# Altium project MQP_DC_AC_Inverter.PrjPcb (part 2 of 4)
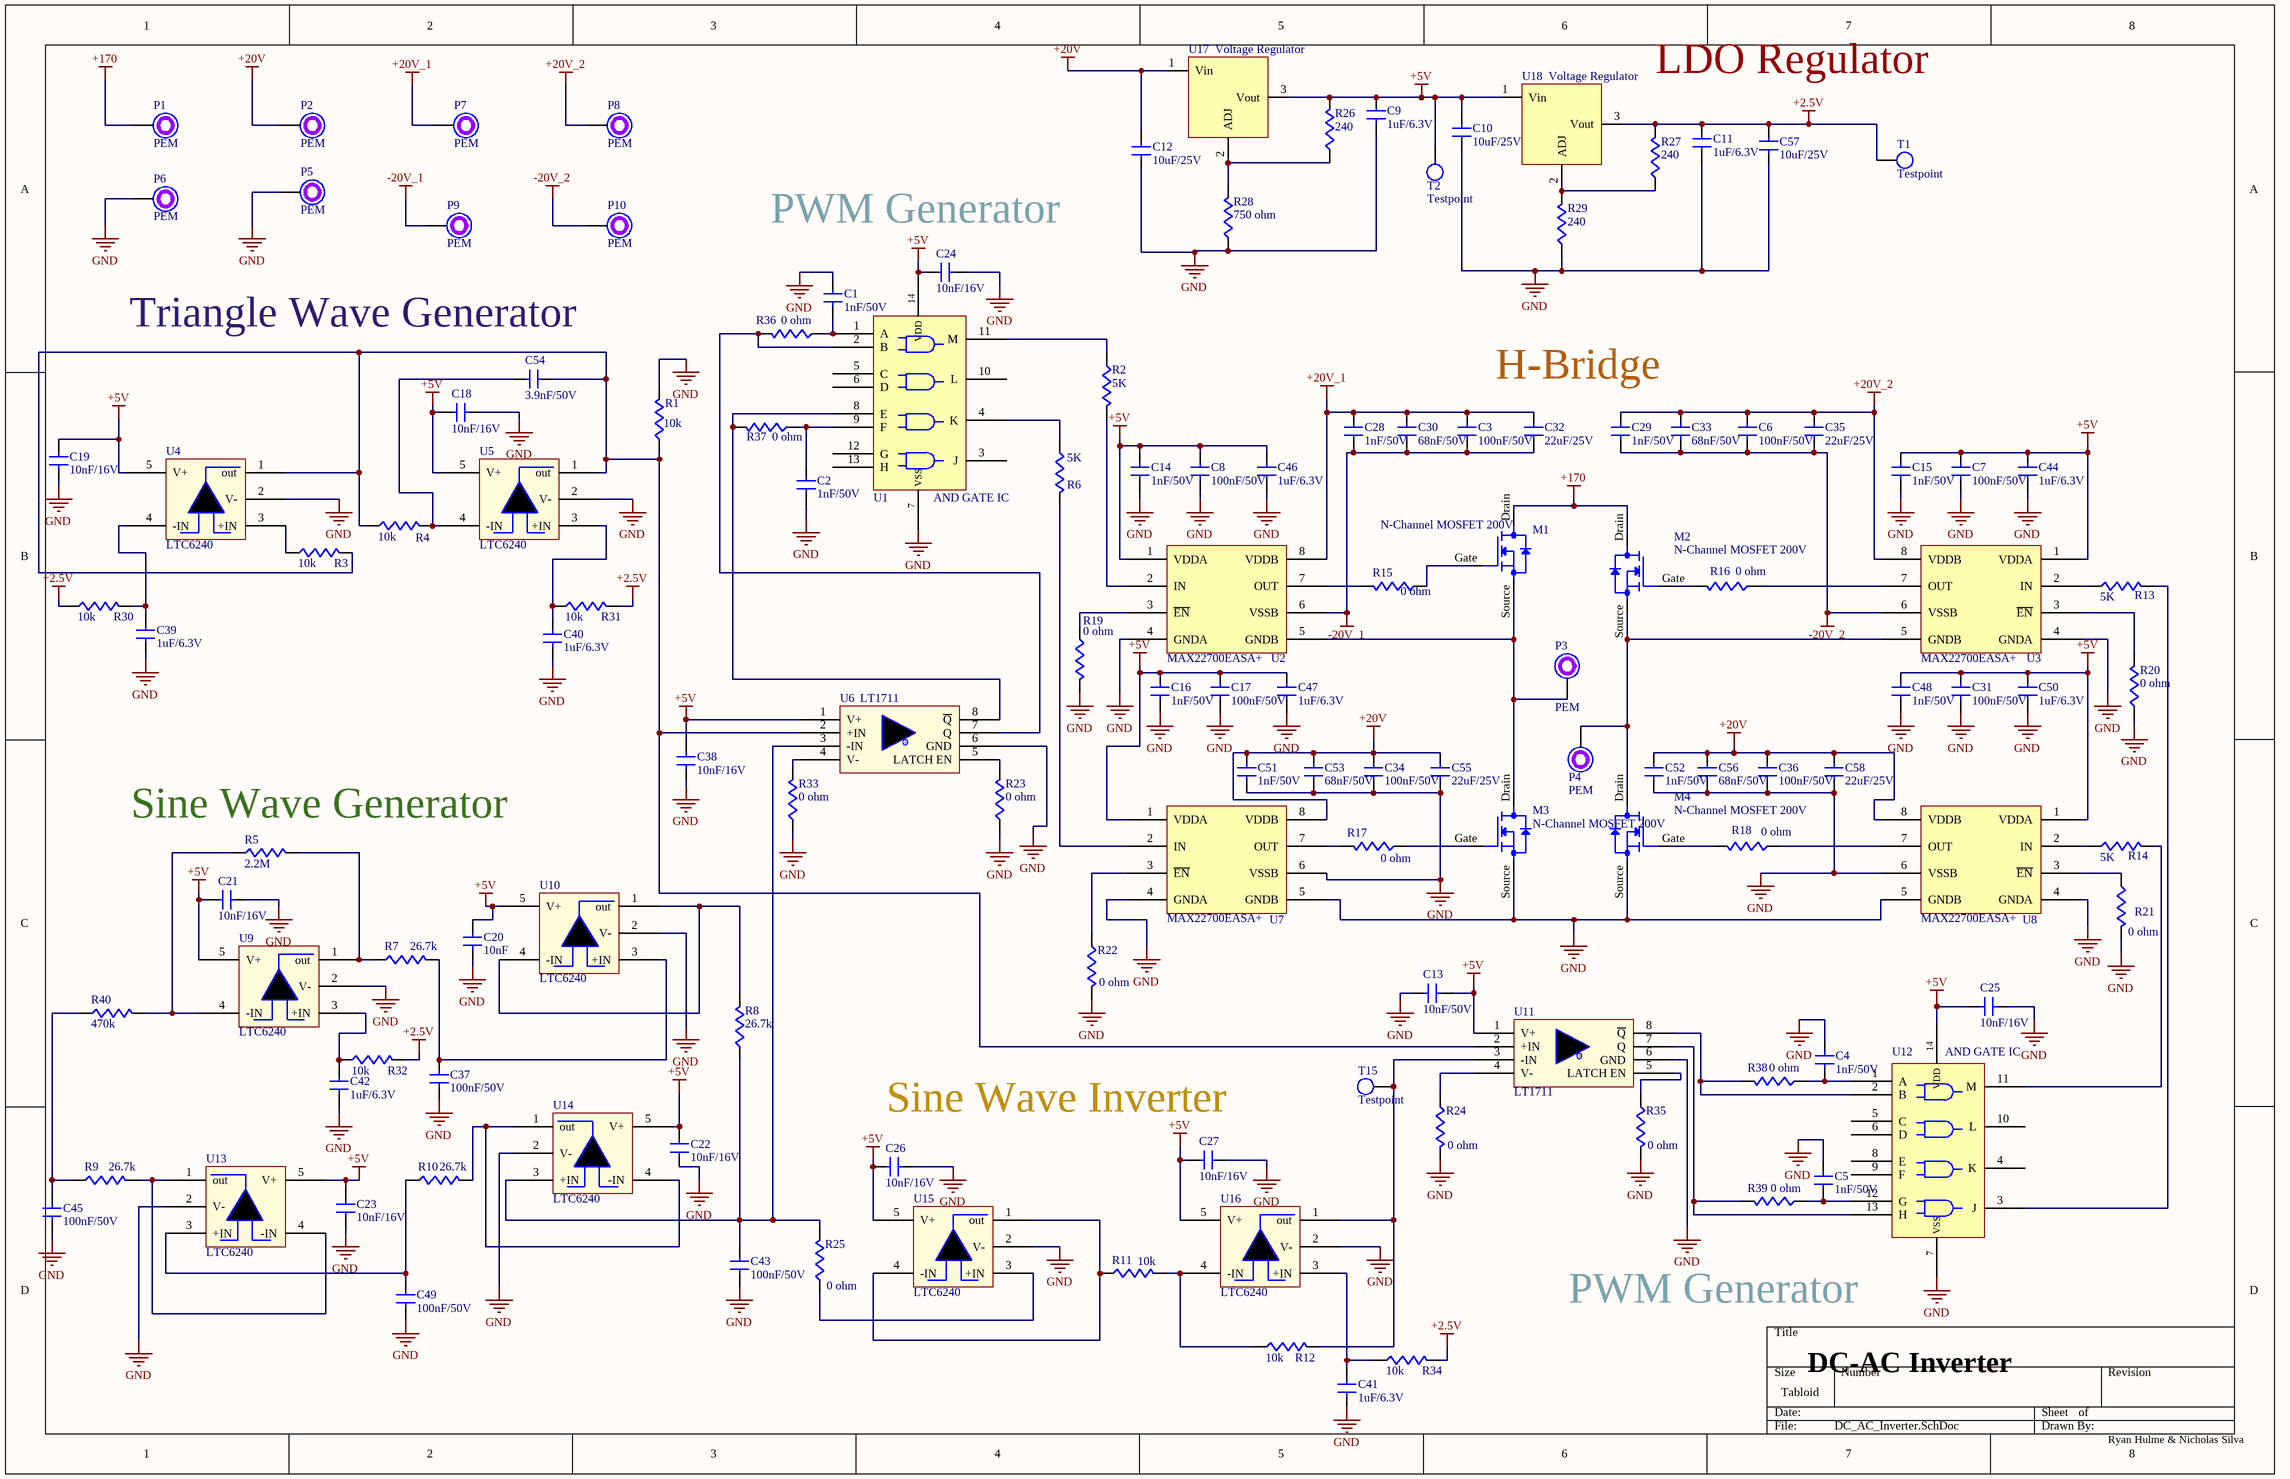
[diagram p1: DC_AC_Inverter.SchDoc]

## Sheet DC_AC_Inverter.SchDoc (continued)
### Library data of the parts
C1 C2 C4 C5 C14-C16 C28 C29 C48 C51 C52 = C0603C102K5RACTU: Multilayer Ceramic Capacitors Mlcc - Smd/Smt 50V 1000Pf X7R 0603 10%; Manufacturer: KEMET; Dissipation Factor: 2.5%; Temperature Coefficient: 30ppm/°C; Value: 1nF; Supplier: DigiKey; Supplier Part Number: 399-C0603C102K5RACTUDKR-ND; Manufacturer Part Number: C0603C102K5RACTU; RoHS: Compliant; Category: Ceramic Capacitors; Stock: 3544038; Pricing: 1=0.08, 10=0.014, 50=0.012, 100=0.0096 (USD); Case/Package: 0603; Case Code (Imperial): 0603; China RoHS: Compliant; Contact Plating: Tin; Depth: 800µm; Dielectric: X7R; Dielectric Material: Ceramic; Height: 800µm; Lead Free: Lead Free; Lead Pitch: 700µm; Length: 1.6mm; Lifecycle Status: Production; Material: Ceramic; Max Operating Temperature: 125°C; Min Operating Temperature: -55°C; Mounting Technology: Surface Mount; Pins: 2; Number of Terminals: 2; Packaging: Cut Tape; Radiation Hardening: No; REACH SVHC: Yes; Schedule B: 8532240020, 8532240020|8532240020, 8532240020|8532240020|8532240020, 8532240020|8532240020|8532240020|8532240020; Termination: SMD/SMT; Thickness: 863.6µm; Tolerance: 10%; Voltage: 50V; Voltage Rating: 50V; Voltage Rating (AC): 50V; Voltage Rating (DC): 50V; Width: 800µm; ComponentLink1URL: https://datasheet.octopart.com:443/C0603C102K5RAC7867-KEMET-datasheet-179096092.pdf?src-supplier=IHS; ComponentLink1Description: https://datasheet.octopart.com:443/C0603C102K5RAC7867-KEMET-datasheet-179096092.pdf?src-supplier=IHS; ComponentLink2URL: https://datasheet.octopart.com:443/C0603C102K5RACTU-KEMET-datasheet-178445679.pdf?src-supplier=IHS; ComponentLink2Description: https://datasheet.octopart.com:443/C0603C102K5RACTU-KEMET-datasheet-178445679.pdf?src-supplier=IHS; ComponentLink3URL: https://datasheet.octopart.com:443/C0603C102K5RACTU-KEMET-datasheet-137357759.pdf?src-supplier=Farnell; ComponentLink3Description: https://datasheet.octopart.com:443/C0603C102K5RACTU-KEMET-datasheet-137357759.pdf?src-supplier=Farnell; ComponentLink4URL: https://datasheet.octopart.com:443/C0603C102K5RAC-TU-Kemet-datasheet-5313890.pdf?src-supplier=Farnell; ComponentLink4Description: https://datasheet.octopart.com:443/C0603C102K5RAC-TU-Kemet-datasheet-5313890.pdf?src-supplier=Farnell; ComponentLink5URL: https://datasheet.octopart.com:443/C0603C102K5RACTU-Kemet-datasheet-8764837.pdf?src-supplier=Farnell; ComponentLink5Description: https://datasheet.octopart.com:443/C0603C102K5RACTU-Kemet-datasheet-8764837.pdf?src-supplier=Farnell; ComponentLink6URL: https://datasheet.octopart.com:443/C0603C102K5RACTU-Kemet-datasheet-8480123.pdf?src-supplier=Farnell; ComponentLink6Description: https://datasheet.octopart.com:443/C0603C102K5RACTU-Kemet-datasheet-8480123.pdf?src-supplier=Farnell; ComponentLink7URL: https://datasheet.octopart.com:443/C0603C102K5RAC-TU-Kemet-datasheet-5390537.pdf?src-supplier=Farnell; ComponentLink7Description: https://datasheet.octopart.com:443/C0603C102K5RAC-TU-Kemet-datasheet-5390537.pdf?src-supplier=Farnell; ComponentLink8URL: https://datasheet.octopart.com:443/C0603C102K5RACTU-Kemet-datasheet-5393970.pdf?src-supplier=Farnell; ComponentLink8Description: https://datasheet.octopart.com:443/C0603C102K5RACTU-Kemet-datasheet-5393970.pdf?src-supplier=Farnell; ComponentLink9URL: https://datasheet.octopart.com:443/C0603C102K5RACTU-Kemet-datasheet-8502025.pdf?src-supplier=Farnell; ComponentLink9Description: https://datasheet.octopart.com:443/C0603C102K5RACTU-Kemet-datasheet-8502025.pdf?src-supplier=Farnell; ComponentLink10URL: https://datasheet.octopart.com:443/C0603C102K5RAC-TU-Kemet-datasheet-7541751.pdf?src-supplier=Farnell; ComponentLink10Description: https://datasheet.octopart.com:443/C0603C102K5RAC-TU-Kemet-datasheet-7541751.pdf?src-supplier=Farnell; ComponentLink11URL: https://datasheet.octopart.com:443/C0603C102K5RACTU-Kemet-datasheet-161801.pdf?src-supplier=Farnell; ComponentLink11Description: https://datasheet.octopart.com:443/C0603C102K5RACTU-Kemet-datasheet-161801.pdf?src-supplier=Farnell; ComponentLink12URL: https://datasheet.octopart.com:443/C0603C102K5RACTU-KEMET-datasheet-101575634.pdf?src-supplier=Farnell; ComponentLink12Description: https://datasheet.octopart.com:443/C0603C102K5RACTU-KEMET-datasheet-101575634.pdf?src-supplier=Farnell; ComponentLink13URL: https://datasheet.octopart.com:443/C0603C102K5RACTU.-Kemet-datasheet-41232427.pdf?src-supplier=Farnell; ComponentLink13Description: https://datasheet.octopart.com:443/C0603C102K5RACTU.-Kemet-datasheet-41232427.pdf?src-supplier=Farnell; ComponentLink14URL: https://datasheet.octopart.com:443/C0603C102K5RACTU-KEMET-datasheet-176142151.pdf?src-supplier=Farnell; ComponentLink14Description: https://datasheet.octopart.com:443/C0603C102K5RACTU-KEMET-datasheet-176142151.pdf?src-supplier=Farnell; ComponentLink15URL: https://datasheet.octopart.com:443/C0603C102K5RACTU-KEMET-datasheet-130256537.pdf?src-supplier=Farnell; ComponentLink15Description: https://datasheet.octopart.com:443/C0603C102K5RACTU-KEMET-datasheet-130256537.pdf?src-supplier=Farnell; ComponentLink16URL: https://datasheet.octopart.com:443/C0603C102K5RACTU-Kemet-datasheet-14356739.pdf?src-supplier=Farnell; ComponentLink16Description: https://datasheet.octopart.com:443/C0603C102K5RACTU-Kemet-datasheet-14356739.pdf?src-supplier=Farnell; ComponentLink17URL: https://datasheet.octopart.com:443/C0603C102K5RAC-TU-Kemet-datasheet-7833651.pdf?src-supplier=Farnell; ComponentLink17Description: https://datasheet.octopart.com:443/C0603C102K5RAC-TU-Kemet-datasheet-7833651.pdf?src-supplier=Farnell; ComponentLink18URL: https://datasheet.octopart.com:443/C0603C102K5RAC-TU-Kemet-datasheet-7601896.pdf?src-supplier=Farnell; ComponentLink18Description: https://datasheet.octopart.com:443/C0603C102K5RAC-TU-Kemet-datasheet-7601896.pdf?src-supplier=Farnell; ComponentLink19URL: https://datasheet.octopart.com:443/C0603C102K5RAC-TU-Kemet-datasheet-5316294.pdf?src-supplier=Farnell; ComponentLink19Description: https://datasheet.octopart.com:443/C0603C102K5RAC-TU-Kemet-datasheet-5316294.pdf?src-supplier=Farnell; ComponentLink20URL: https://datasheet.octopart.com:443/C0603C102K5RAC-TU-Kemet-datasheet-5314837.pdf?src-supplier=Farnell; ComponentLink20Description: https://datasheet.octopart.com:443/C0603C102K5RAC-TU-Kemet-datasheet-5314837.pdf?src-supplier=Farnell; ComponentLink21URL: https://datasheet.octopart.com:443/C0603C102K5RAC-TU-Kemet-datasheet-8092359.pdf?src-supplier=Farnell; ComponentLink21Description: https://datasheet.octopart.com:443/C0603C102K5RAC-TU-Kemet-datasheet-8092359.pdf?src-supplier=Farnell; ComponentLink22URL: https://datasheet.octopart.com:443/C0603C102K5RAC-TU-Kemet-datasheet-5314449.pdf?src-supplier=Farnell; ComponentLink22Description: https://datasheet.octopart.com:443/C0603C102K5RAC-TU-Kemet-datasheet-5314449.pdf?src-supplier=Farnell; ComponentLink23URL: https://datasheet.octopart.com:443/C0603C102K5RAC-TU-Kemet-datasheet-5314969.pdf?src-supplier=Farnell; ComponentLink23Description: https://datasheet.octopart.com:443/C0603C102K5RAC-TU-Kemet-datasheet-5314969.pdf?src-supplier=Farnell; ComponentLink24URL: https://datasheet.octopart.com:443/C0603C102K5RAC-TU-Kemet-datasheet-5314627.pdf?src-supplier=Farnell; ComponentLink24Description: https://datasheet.octopart.com:443/C0603C102K5RAC-TU-Kemet-datasheet-5314627.pdf?src-supplier=Farnell; ComponentLink25URL: https://datasheet.octopart.com:443/C0603C102K5RAC-TU-Kemet-datasheet-5389132.pdf?src-supplier=Farnell; ComponentLink25Description: https://datasheet.octopart.com:443/C0603C102K5RAC-TU-Kemet-datasheet-5389132.pdf?src-supplier=Farnell; ComponentLink26URL: https://datasheet.octopart.com:443/C0603C102K5RAC-TU-Kemet-datasheet-5313836.pdf?src-supplier=Farnell; ComponentLink26Description: https://datasheet.octopart.com:443/C0603C102K5RAC-TU-Kemet-datasheet-5313836.pdf?src-supplier=Farnell; ComponentLink27URL: https://datasheet.octopart.com:443/C0603C102K5RAC-TU-Kemet-datasheet-8111010.pdf?src-supplier=Farnell; ComponentLink27Description: https://datasheet.octopart.com:443/C0603C102K5RAC-TU-Kemet-datasheet-8111010.pdf?src-supplier=Farnell; ComponentLink28URL: https://datasheet.octopart.com:443/C0603C102K5RAC-TU-Kemet-datasheet-7627733.pdf?src-supplier=Farnell; ComponentLink28Description: https://datasheet.octopart.com:443/C0603C102K5RAC-TU-Kemet-datasheet-7627733.pdf?src-supplier=Farnell; ComponentLink29URL: https://datasheet.octopart.com:443/C0603C102K5RACTU-Kemet-datasheet-500041.pdf?src-supplier=Farnell; ComponentLink29Description: https://datasheet.octopart.com:443/C0603C102K5RACTU-Kemet-datasheet-500041.pdf?src-supplier=Farnell; ComponentLink30URL: https://datasheet.octopart.com:443/C0603C102K5RAC-TU-Kemet-datasheet-5315946.pdf?src-supplier=Farnell; ComponentLink30Description: https://datasheet.octopart.com:443/C0603C102K5RAC-TU-Kemet-datasheet-5315946.pdf?src-supplier=Farnell; ComponentLink31URL: https://datasheet.octopart.com:443/C0603C102K5RACTU-KEMET-datasheet-137357764.pdf?src-supplier=Upverter; ComponentLink31Description: https://datasheet.octopart.com:443/C0603C102K5RACTU-KEMET-datasheet-137357764.pdf?src-supplier=Upverter; ComponentLink32URL: https://datasheet.octopart.com:443/C0603C102K5RAC7867-KEMET-datasheet-188512054.pdf?src-supplier=ODG+(Origin+Data+Global); ComponentLink32Description: https://datasheet.octopart.com:443/C0603C102K5RAC7867-KEMET-datasheet-188512054.pdf?src-supplier=ODG+(Origin+Data+Global); ComponentLink33URL: https://datasheet.octopart.com:443/C0603C102K5RACTU-KEMET-datasheet-32036385.pdf?src-supplier=Electro+Sonic; ComponentLink33Description: https://datasheet.octopart.com:443/C0603C102K5RACTU-KEMET-datasheet-32036385.pdf?src-supplier=Electro+Sonic; ComponentLink34URL: https://datasheet.octopart.com:443/C0603C102K5RACTU-KEMET-datasheet-157246124.pdf?src-supplier=Electro+Sonic; ComponentLink34Description: https://datasheet.octopart.com:443/C0603C102K5RACTU-KEMET-datasheet-157246124.pdf?src-supplier=Electro+Sonic; ComponentLink35URL: https://datasheet.octopart.com:443/C0603C102K5RACTU-KEMET-datasheet-176142155.pdf?src-supplier=Newark; ComponentLink35Description: https://datasheet.octopart.com:443/C0603C102K5RACTU-KEMET-datasheet-176142155.pdf?src-supplier=Newark; ComponentLink36URL: https://datasheet.octopart.com:443/C0603C102K5RACTU-Kemet-datasheet-27203261.pdf?src-supplier=Newark; ComponentLink36Description: https://datasheet.octopart.com:443/C0603C102K5RACTU-Kemet-datasheet-27203261.pdf?src-supplier=Newark; ComponentLink37URL: https://datasheet.octopart.com:443/C0603C102K5RACTU-KEMET-datasheet-164512540.pdf?src-supplier=TME; ComponentLink37Description: https://datasheet.octopart.com:443/C0603C102K5RACTU-KEMET-datasheet-164512540.pdf?src-supplier=TME; ComponentLink38URL: https://datasheet.octopart.com:443/C0603C102K5RACTU-Kemet-datasheet-67830780.pdf?src-supplier=TME; ComponentLink38Description: https://datasheet.octopart.com:443/C0603C102K5RACTU-Kemet-datasheet-67830780.pdf?src-supplier=TME; ComponentLink39URL: https://datasheet.octopart.com:443/C0603C102K5RACTU-KEMET-datasheet-134791355.pdf?src-supplier=TME; ComponentLink39Description: https://datasheet.octopart.com:443/C0603C102K5RACTU-KEMET-datasheet-134791355.pdf?src-supplier=TME; ComponentLink40URL: https://datasheet.octopart.com:443/C0603C102K5RACTU-KEMET-datasheet-68331906.pdf?src-supplier=TME; ComponentLink40Description: https://datasheet.octopart.com:443/C0603C102K5RACTU-KEMET-datasheet-68331906.pdf?src-supplier=TME; ComponentLink41URL: https://datasheet.octopart.com:443/C0603C102K5RACTU-KEMET-datasheet-110724412.pdf?src-supplier=RS+(Formerly+Allied+Electronics); ComponentLink41Description: https://datasheet.octopart.com:443/C0603C102K5RACTU-KEMET-datasheet-110724412.pdf?src-supplier=RS+(Formerly+Allied+Electronics); ComponentLink42URL: https://datasheet.octopart.com:443/C0603C102K5RACTU-Kemet-datasheet-464.pdf?src-supplier=RS+(Formerly+Allied+Electronics); ComponentLink42Description: https://datasheet.octopart.com:443/C0603C102K5RACTU-Kemet-datasheet-464.pdf?src-supplier=RS+(Formerly+Allied+Electronics); ComponentLink43URL: https://datasheet.octopart.com/C0603C102K5RACTU-KEMET-datasheet-84169754.pdf; ComponentLink43Description: https://datasheet.octopart.com/C0603C102K5RACTU-KEMET-datasheet-84169754.pdf; ComponentLink44URL: https://datasheet.octopart.com:443/C0603C102K5RACTU-Kemet-datasheet-22084244.pdf?src-supplier=element14+APAC; ComponentLink44Description: https://datasheet.octopart.com:443/C0603C102K5RACTU-Kemet-datasheet-22084244.pdf?src-supplier=element14+APAC; ComponentLink45URL: https://datasheet.octopart.com:443/C0603C102K5RAC7867-KEMET-datasheet-164857143.pdf?src-supplier=Burklin+Elektronik; ComponentLink45Description: https://datasheet.octopart.com:443/C0603C102K5RAC7867-KEMET-datasheet-164857143.pdf?src-supplier=Burklin+Elektronik
C3 C6-C8 C17 C31 C34 C36 C37 C43 C45 C49 = C0603C104K5RACTU: 50V 100nF X7R ±10% 0603 Multilayer Ceramic Capacitors MLCC - SMD/SMT ROHS; Manufacturer: KEMET; Dissipation Factor: 2.5%; Temperature Coefficient: 30ppm/°C; Supplier: DigiKey; Supplier Part Number: 399-C0603C104K5RACTUCT-ND; Manufacturer Part Number: C0603C104K5RACTU; RoHS: Compliant; Category: Ceramic Capacitors; Stock: 12623196; Pricing: 1=0.08, 10=0.011 (USD); Value: 100nF; Case/Package: 0603; Case Code (Imperial): 0603; China RoHS: Compliant; Contact Plating: Tin; Country of Origin: Mexico; Depth: 800µm; Dielectric: X7R; Dielectric Material: Ceramic; Export Control Classification Number (ECCN) Code: EAR99; Height: 800µm; Harmonized Tariff Schedule (HTS) Code: 8532.24.00.20; Introduction Date: 2011-07-27; Lead Free: Lead Free; Lead Pitch: 700µm; Length: 1.6mm; Lifecycle Status: Production; Material: Ceramic; Max Operating Temperature: 125°C; Min Operating Temperature: -55°C; Mounting Technology: Surface Mount; Pins: 2; Number of Terminals: 2; Packaging: Tape & Reel; Radiation Hardening: No; REACH SVHC: Yes; Schedule B: 8532240020, 8532240020|8532240020, 8532240020|8532240020|8532240020, 8532240020|8532240020|8532240020|8532240020; Termination: SMD/SMT; Thickness: 863.6µm; Tolerance: 10%; Voltage: 50V; Voltage Rating: 50V; Voltage Rating (DC): 50V; Width: 800µm; ComponentLink1URL: https://datasheet.octopart.com:443/C0603C104K5RACTU-KEMET-datasheet-178445679.pdf?src-supplier=IHS; ComponentLink1Description: https://datasheet.octopart.com:443/C0603C104K5RACTU-KEMET-datasheet-178445679.pdf?src-supplier=IHS; ComponentLink2URL: https://datasheet.octopart.com:443/C0603C104K5RAC7867-KEMET-datasheet-184792804.pdf?src-supplier=IHS; ComponentLink2Description: https://datasheet.octopart.com:443/C0603C104K5RAC7867-KEMET-datasheet-184792804.pdf?src-supplier=IHS; ComponentLink3URL: https://datasheet.octopart.com:443/C0603C104K5RACTU-KEMET-datasheet-137357759.pdf?src-supplier=Farnell; ComponentLink3Description: https://datasheet.octopart.com:443/C0603C104K5RACTU-KEMET-datasheet-137357759.pdf?src-supplier=Farnell; ComponentLink4URL: https://datasheet.octopart.com:443/C0603C104K5RACTU-KEMET-datasheet-149521864.pdf?src-supplier=Farnell; ComponentLink4Description: https://datasheet.octopart.com:443/C0603C104K5RACTU-KEMET-datasheet-149521864.pdf?src-supplier=Farnell; ComponentLink5URL: https://datasheet.octopart.com:443/C0603C104K5RACTU-KEMET-datasheet-101575654.pdf?src-supplier=Farnell; ComponentLink5Description: https://datasheet.octopart.com:443/C0603C104K5RACTU-KEMET-datasheet-101575654.pdf?src-supplier=Farnell; ComponentLink6URL: https://datasheet.octopart.com:443/C0603C104K5RACTU-KEMET-datasheet-176142159.pdf?src-supplier=Farnell; ComponentLink6Description: https://datasheet.octopart.com:443/C0603C104K5RACTU-KEMET-datasheet-176142159.pdf?src-supplier=Farnell; ComponentLink7URL: https://datasheet.octopart.com:443/C0603C104K5RAC-TU-Kemet-datasheet-7833651.pdf?src-supplier=Farnell; ComponentLink7Description: https://datasheet.octopart.com:443/C0603C104K5RAC-TU-Kemet-datasheet-7833651.pdf?src-supplier=Farnell; ComponentLink8URL: https://datasheet.octopart.com:443/C0603C104K5RAC-TU-Kemet-datasheet-7601896.pdf?src-supplier=Farnell; ComponentLink8Description: https://datasheet.octopart.com:443/C0603C104K5RAC-TU-Kemet-datasheet-7601896.pdf?src-supplier=Farnell; ComponentLink9URL: https://datasheet.octopart.com:443/C0603C104K5RAC-TU-Kemet-datasheet-5316294.pdf?src-supplier=Farnell; ComponentLink9Description: https://datasheet.octopart.com:443/C0603C104K5RAC-TU-Kemet-datasheet-5316294.pdf?src-supplier=Farnell; ComponentLink10URL: https://datasheet.octopart.com:443/C0603C104K5RAC-TU-Kemet-datasheet-5314837.pdf?src-supplier=Farnell; ComponentLink10Description: https://datasheet.octopart.com:443/C0603C104K5RAC-TU-Kemet-datasheet-5314837.pdf?src-supplier=Farnell; ComponentLink11URL: https://datasheet.octopart.com:443/C0603C104K5RAC-TU-Kemet-datasheet-8092359.pdf?src-supplier=Farnell; ComponentLink11Description: https://datasheet.octopart.com:443/C0603C104K5RAC-TU-Kemet-datasheet-8092359.pdf?src-supplier=Farnell; ComponentLink12URL: https://datasheet.octopart.com:443/C0603C104K5RAC-TU-Kemet-datasheet-5314449.pdf?src-supplier=Farnell; ComponentLink12Description: https://datasheet.octopart.com:443/C0603C104K5RAC-TU-Kemet-datasheet-5314449.pdf?src-supplier=Farnell; ComponentLink13URL: https://datasheet.octopart.com:443/C0603C104K5RAC-TU-Kemet-datasheet-5314969.pdf?src-supplier=Farnell; ComponentLink13Description: https://datasheet.octopart.com:443/C0603C104K5RAC-TU-Kemet-datasheet-5314969.pdf?src-supplier=Farnell; ComponentLink14URL: https://datasheet.octopart.com:443/C0603C104K5RAC-TU-Kemet-datasheet-5314627.pdf?src-supplier=Farnell; ComponentLink14Description: https://datasheet.octopart.com:443/C0603C104K5RAC-TU-Kemet-datasheet-5314627.pdf?src-supplier=Farnell; ComponentLink15URL: https://datasheet.octopart.com:443/C0603C104K5RAC-TU-Kemet-datasheet-5389132.pdf?src-supplier=Farnell; ComponentLink15Description: https://datasheet.octopart.com:443/C0603C104K5RAC-TU-Kemet-datasheet-5389132.pdf?src-supplier=Farnell; ComponentLink16URL: https://datasheet.octopart.com:443/C0603C104K5RAC-TU-Kemet-datasheet-5313836.pdf?src-supplier=Farnell; ComponentLink16Description: https://datasheet.octopart.com:443/C0603C104K5RAC-TU-Kemet-datasheet-5313836.pdf?src-supplier=Farnell; ComponentLink17URL: https://datasheet.octopart.com:443/C0603C104K5RAC-TU-Kemet-datasheet-8111010.pdf?src-supplier=Farnell; ComponentLink17Description: https://datasheet.octopart.com:443/C0603C104K5RAC-TU-Kemet-datasheet-8111010.pdf?src-supplier=Farnell; ComponentLink18URL: https://datasheet.octopart.com:443/C0603C104K5RAC-TU-Kemet-datasheet-7627733.pdf?src-supplier=Farnell; ComponentLink18Description: https://datasheet.octopart.com:443/C0603C104K5RAC-TU-Kemet-datasheet-7627733.pdf?src-supplier=Farnell; ComponentLink19URL: https://datasheet.octopart.com:443/C0603C104K5RAC-TU-Kemet-datasheet-5315946.pdf?src-supplier=Farnell; ComponentLink19Description: https://datasheet.octopart.com:443/C0603C104K5RAC-TU-Kemet-datasheet-5315946.pdf?src-supplier=Farnell; ComponentLink20URL: https://datasheet.octopart.com:443/C0603C104K5RACTU-KEMET-datasheet-137357764.pdf?src-supplier=Upverter; ComponentLink20Description: https://datasheet.octopart.com:443/C0603C104K5RACTU-KEMET-datasheet-137357764.pdf?src-supplier=Upverter; ComponentLink21URL: https://datasheet.octopart.com:443/C0603C104K5RAC-TU-Kemet-datasheet-5313890.pdf?src-supplier=Newark; ComponentLink21Description: https://datasheet.octopart.com:443/C0603C104K5RAC-TU-Kemet-datasheet-5313890.pdf?src-supplier=Newark; ComponentLink22URL: https://datasheet.octopart.com:443/C0603C104K5RACTU-Kemet-datasheet-12608295.pdf?src-supplier=Newark; ComponentLink22Description: https://datasheet.octopart.com:443/C0603C104K5RACTU-Kemet-datasheet-12608295.pdf?src-supplier=Newark; ComponentLink23URL: https://datasheet.octopart.com:443/C0603C104K5RACTU-Kemet-datasheet-11992184.pdf?src-supplier=Newark; ComponentLink23Description: https://datasheet.octopart.com:443/C0603C104K5RACTU-Kemet-datasheet-11992184.pdf?src-supplier=Newark; ComponentLink24URL: https://datasheet.octopart.com:443/C0603C104K5RACTU-Kemet-datasheet-10942409.pdf?src-supplier=Newark; ComponentLink24Description: https://datasheet.octopart.com:443/C0603C104K5RACTU-Kemet-datasheet-10942409.pdf?src-supplier=Newark; ComponentLink25URL: https://datasheet.octopart.com:443/C0603C104K5RACTU-Kemet-datasheet-10404442.pdf?src-supplier=Newark; ComponentLink25Description: https://datasheet.octopart.com:443/C0603C104K5RACTU-Kemet-datasheet-10404442.pdf?src-supplier=Newark; ComponentLink26URL: https://datasheet.octopart.com:443/C0603C104K5RAC-TU-Kemet-datasheet-5390537.pdf?src-supplier=Newark; ComponentLink26Description: https://datasheet.octopart.com:443/C0603C104K5RAC-TU-Kemet-datasheet-5390537.pdf?src-supplier=Newark; ComponentLink27URL: https://datasheet.octopart.com:443/C0603C104K5RAC-TU-Kemet-datasheet-7541751.pdf?src-supplier=Newark; ComponentLink27Description: https://datasheet.octopart.com:443/C0603C104K5RAC-TU-Kemet-datasheet-7541751.pdf?src-supplier=Newark; ComponentLink28URL: https://datasheet.octopart.com:443/C0603C104K5RACTU-KEMET-datasheet-171829795.pdf?src-supplier=Newark; ComponentLink28Description: https://datasheet.octopart.com:443/C0603C104K5RACTU-KEMET-datasheet-171829795.pdf?src-supplier=Newark; ComponentLink29URL: https://datasheet.octopart.com:443/C0603C104K5RACTU-Kemet-datasheet-8764837.pdf?src-supplier=Newark; ComponentLink29Description: https://datasheet.octopart.com:443/C0603C104K5RACTU-Kemet-datasheet-8764837.pdf?src-supplier=Newark; ComponentLink30URL: https://datasheet.octopart.com:443/C0603C104K5RACTU-Kemet-datasheet-8480123.pdf?src-supplier=Newark; ComponentLink30Description: https://datasheet.octopart.com:443/C0603C104K5RACTU-Kemet-datasheet-8480123.pdf?src-supplier=Newark; ComponentLink31URL: https://datasheet.octopart.com:443/C0603C104K5RACTU-Kemet-datasheet-5393970.pdf?src-supplier=Newark; ComponentLink31Description: https://datasheet.octopart.com:443/C0603C104K5RACTU-Kemet-datasheet-5393970.pdf?src-supplier=Newark; ComponentLink32URL: https://datasheet.octopart.com:443/C0603C104K5RACTU-Kemet-datasheet-8502025.pdf?src-supplier=Newark; ComponentLink32Description: https://datasheet.octopart.com:443/C0603C104K5RACTU-Kemet-datasheet-8502025.pdf?src-supplier=Newark; ComponentLink33URL: https://datasheet.octopart.com:443/C0603C104K5RACTU-Kemet-datasheet-161801.pdf?src-supplier=Newark; ComponentLink33Description: https://datasheet.octopart.com:443/C0603C104K5RACTU-Kemet-datasheet-161801.pdf?src-supplier=Newark; ComponentLink34URL: https://datasheet.octopart.com:443/C0603C104K5RACTU-Kemet-datasheet-32036385.pdf?src-supplier=Electro+Sonic; ComponentLink34Description: https://datasheet.octopart.com:443/C0603C104K5RACTU-Kemet-datasheet-32036385.pdf?src-supplier=Electro+Sonic; ComponentLink35URL: https://datasheet.octopart.com:443/C0603C104K5RACTU-KEMET-datasheet-157246124.pdf?src-supplier=Electro+Sonic; ComponentLink35Description: https://datasheet.octopart.com:443/C0603C104K5RACTU-KEMET-datasheet-157246124.pdf?src-supplier=Electro+Sonic; ComponentLink36URL: https://datasheet.octopart.com:443/C0603C104K5RACTU-KEMET-datasheet-164512540.pdf?src-supplier=TME; ComponentLink36Description: https://datasheet.octopart.com:443/C0603C104K5RACTU-KEMET-datasheet-164512540.pdf?src-supplier=TME; ComponentLink37URL: https://datasheet.octopart.com:443/C0603C104K5RACTU-Kemet-datasheet-67830781.pdf?src-supplier=TME; ComponentLink37Description: https://datasheet.octopart.com:443/C0603C104K5RACTU-Kemet-datasheet-67830781.pdf?src-supplier=TME; ComponentLink38URL: https://datasheet.octopart.com:443/C0603C104K5RACTU-KEMET-datasheet-68331906.pdf?src-supplier=TME; ComponentLink38Description: https://datasheet.octopart.com:443/C0603C104K5RACTU-KEMET-datasheet-68331906.pdf?src-supplier=TME; ComponentLink39URL: https://datasheet.octopart.com:443/C0603C104K5RAC7867-Kemet-datasheet-62098571.pdf?src-supplier=TME; ComponentLink39Description: https://datasheet.octopart.com:443/C0603C104K5RAC7867-Kemet-datasheet-62098571.pdf?src-supplier=TME; ComponentLink40URL: https://datasheet.octopart.com:443/C0603C104K5RAC7867-Kemet-datasheet-17577222.pdf?src-supplier=TME; ComponentLink40Description: https://datasheet.octopart.com:443/C0603C104K5RAC7867-Kemet-datasheet-17577222.pdf?src-supplier=TME; ComponentLink41URL: https://datasheet.octopart.com:443/C0603C104K5RACTU-KEMET-datasheet-110724412.pdf?src-supplier=RS+(Formerly+Allied+Electronics); ComponentLink41Description: https://datasheet.octopart.com:443/C0603C104K5RACTU-KEMET-datasheet-110724412.pdf?src-supplier=RS+(Formerly+Allied+Electronics); ComponentLink42URL: https://datasheet.octopart.com:443/C0603C104K5RACTU-Kemet-datasheet-464.pdf?src-supplier=RS+(Formerly+Allied+Electronics); ComponentLink42Description: https://datasheet.octopart.com:443/C0603C104K5RACTU-Kemet-datasheet-464.pdf?src-supplier=RS+(Formerly+Allied+Electronics); ComponentLink43URL: https://datasheet.octopart.com/C0603C104K5RACTU-KEMET-datasheet-84169754.pdf; ComponentLink43Description: https://datasheet.octopart.com/C0603C104K5RACTU-KEMET-datasheet-84169754.pdf; ComponentLink44URL: https://datasheet.octopart.com:443/C0603C104K5RACTU-Kemet-datasheet-24570007.pdf?src-supplier=element14+APAC; ComponentLink44Description: https://datasheet.octopart.com:443/C0603C104K5RACTU-Kemet-datasheet-24570007.pdf?src-supplier=element14+APAC; ComponentLink45URL: https://datasheet.octopart.com:443/C0603C104K5RACTU-Kemet-datasheet-22084244.pdf?src-supplier=element14+APAC; ComponentLink45Description: https://datasheet.octopart.com:443/C0603C104K5RACTU-Kemet-datasheet-22084244.pdf?src-supplier=element14+APAC; ComponentLink46URL: https://datasheet.octopart.com:443/C0603C104K5RACTU-Kemet-datasheet-21389238.pdf?src-supplier=element14+APAC; ComponentLink46Description: https://datasheet.octopart.com:443/C0603C104K5RACTU-Kemet-datasheet-21389238.pdf?src-supplier=element14+APAC; ComponentLink47URL: https://datasheet.octopart.com:443/C0603C104K5RACTU-Kemet-datasheet-11723057.pdf?src-supplier=Arrow+Electronics; ComponentLink47Description: https://datasheet.octopart.com:443/C0603C104K5RACTU-Kemet-datasheet-11723057.pdf?src-supplier=Arrow+Electronics; ComponentLink48URL: https://datasheet.octopart.com:443/C0603C104K5RAC7867-KEMET-datasheet-164857143.pdf?src-supplier=Burklin+Elektronik; ComponentLink48Description: https://datasheet.octopart.com:443/C0603C104K5RAC7867-KEMET-datasheet-164857143.pdf?src-supplier=Burklin+Elektronik; ComponentLink49URL: https://datasheet.octopart.com:443/C0603C104K5RAC-TU-Kemet-datasheet-8187850.pdf?src-supplier=Jameco; ComponentLink49Description: https://datasheet.octopart.com:443/C0603C104K5RAC-TU-Kemet-datasheet-8187850.pdf?src-supplier=Jameco; ComponentLink50URL: https://datasheet.octopart.com:443/C0603C104K5RACTU-Kemet-datasheet-122295.pdf?src-supplier=DigiKey; ComponentLink50Description: https://datasheet.octopart.com:443/C0603C104K5RACTU-Kemet-datasheet-122295.pdf?src-supplier=DigiKey
C9 C11 C39-C42 C44 C46 C47 C50 = JMK105BJ105KV-F: High Value Multilayer Ceramic Capacitors (High dielectric type) | CAP CER 1UF 6.3V X5R 0402; Manufacturer: Taiyo Yuden; Tolerance: 10%; Value: 1µF; Supplier: DigiKey; Supplier Part Number: 587-1231-1-ND; Manufacturer Part Number: JMK105BJ105KV-F; RoHS: Compliant; Category: Ceramic Capacitors; Stock: 20863025; Pricing: 1=0.08, 10=0.005 (USD); Case/Package: 0402; Case Code (Imperial): 0402; Case Code (Metric): 1005; Composition: Ceramic; Depth: 500µm; Dielectric: X5R; Dielectric Material: Ceramic; Halogen Free: Halogen Free; Height: 500µm; Lead Free: Lead Free; Length: 1mm; Lifecycle Status: NRND; Max Length: 1.05mm; Max Operating Temperature: 85°C; Max Thickness: 550µm; Max Width: 550µm; Min Length: 950µm; Min Operating Temperature: -55°C; Min Thickness: 450µm; Min Width: 450µm; Mounting Technology: Surface Mount; Pins: 2; Number of Terminals: 2; Packaging: Cut Tape; Radiation Hardening: No; REACH SVHC: Yes; Termination: SMD/SMT; Thickness: 558.8µm; Voltage Rating: 6.3V; Voltage Rating (DC): 6.3V; Width: 500µm; ComponentLink1URL: https://datasheet.octopart.com:443/JMK105BJ105KV-F-Taiyo-Yuden-datasheet-182105236.pdf?src-supplier=IHS; ComponentLink1Description: https://datasheet.octopart.com:443/JMK105BJ105KV-F-Taiyo-Yuden-datasheet-182105236.pdf?src-supplier=IHS; ComponentLink2URL: https://datasheet.octopart.com:443/JMK105BJ105KV-F-Taiyo-Yuden-datasheet-100443360.pdf?src-supplier=Upverter; ComponentLink2Description: https://datasheet.octopart.com:443/JMK105BJ105KV-F-Taiyo-Yuden-datasheet-100443360.pdf?src-supplier=Upverter; ComponentLink3URL: https://datasheet.octopart.com:443/JMK105BJ105KV-F-Taiyo-Yuden-datasheet-8857305.pdf?src-supplier=Newark; ComponentLink3Description: https://datasheet.octopart.com:443/JMK105BJ105KV-F-Taiyo-Yuden-datasheet-8857305.pdf?src-supplier=Newark; ComponentLink4URL: https://datasheet.octopart.com:443/JMK105BJ105KV-F-Taiyo-Yuden-datasheet-182874064.pdf?src-supplier=Newark; ComponentLink4Description: https://datasheet.octopart.com:443/JMK105BJ105KV-F-Taiyo-Yuden-datasheet-182874064.pdf?src-supplier=Newark; ComponentLink5URL: https://datasheet.octopart.com:443/JMK105BJ105KV-F-Taiyo-Yuden-datasheet-65970389.pdf?src-supplier=Newark; ComponentLink5Description: https://datasheet.octopart.com:443/JMK105BJ105KV-F-Taiyo-Yuden-datasheet-65970389.pdf?src-supplier=Newark; ComponentLink6URL: https://datasheet.octopart.com:443/JMK105BJ105KV-F-Taiyo-Yuden-datasheet-13695304.pdf?src-supplier=Newark; ComponentLink6Description: https://datasheet.octopart.com:443/JMK105BJ105KV-F-Taiyo-Yuden-datasheet-13695304.pdf?src-supplier=Newark; ComponentLink7URL: https://datasheet.octopart.com:443/JMK105BJ105KV-F-Taiyo-Yuden-datasheet-154808611.pdf?src-supplier=Master+Electronics; ComponentLink7Description: https://datasheet.octopart.com:443/JMK105BJ105KV-F-Taiyo-Yuden-datasheet-154808611.pdf?src-supplier=Master+Electronics; ComponentLink8URL: https://datasheet.octopart.com:443/JMK105BJ105KV-F-Taiyo-Yuden-datasheet-140424376.pdf?src-supplier=Master+Electronics; ComponentLink8Description: https://datasheet.octopart.com:443/JMK105BJ105KV-F-Taiyo-Yuden-datasheet-140424376.pdf?src-supplier=Master+Electronics; ComponentLink9URL: https://datasheet.octopart.com:443/JMK105BJ105KV-F-Taiyo-Yuden-datasheet-138516745.pdf?src-supplier=Master+Electronics; ComponentLink9Description: https://datasheet.octopart.com:443/JMK105BJ105KV-F-Taiyo-Yuden-datasheet-138516745.pdf?src-supplier=Master+Electronics; ComponentLink10URL: https://datasheet.octopart.com:443/JMK105BJ105KV-F-Taiyo-Yuden-datasheet-10851928.pdf?src-supplier=Future+Electronics; ComponentLink10Description: https://datasheet.octopart.com:443/JMK105BJ105KV-F-Taiyo-Yuden-datasheet-10851928.pdf?src-supplier=Future+Electronics; ComponentLink11URL: https://datasheet.octopart.com:443/JMK105BJ105KV-F-Taiyo-Yuden-datasheet-99833418.pdf?src-supplier=Future+Electronics; ComponentLink11Description: https://datasheet.octopart.com:443/JMK105BJ105KV-F-Taiyo-Yuden-datasheet-99833418.pdf?src-supplier=Future+Electronics; ComponentLink12URL: https://datasheet.octopart.com:443/JMK105BJ105KV-F-Taiyo-Yuden-datasheet-120265.pdf?src-supplier=Farnell; ComponentLink12Description: https://datasheet.octopart.com:443/JMK105BJ105KV-F-Taiyo-Yuden-datasheet-120265.pdf?src-supplier=Farnell; ComponentLink13URL: https://datasheet.octopart.com:443/JMK105BJ105KV-F-Taiyo-Yuden-datasheet-10742123.pdf?src-supplier=Farnell; ComponentLink13Description: https://datasheet.octopart.com:443/JMK105BJ105KV-F-Taiyo-Yuden-datasheet-10742123.pdf?src-supplier=Farnell; ComponentLink14URL: https://datasheet.octopart.com:443/JMK105BJ105KV-F-Taiyo-Yuden-datasheet-10545600.pdf?src-supplier=Farnell; ComponentLink14Description: https://datasheet.octopart.com:443/JMK105BJ105KV-F-Taiyo-Yuden-datasheet-10545600.pdf?src-supplier=Farnell; ComponentLink15URL: https://datasheet.octopart.com:443/JMK105BJ105KV-F-Taiyo-Yuden-datasheet-10622963.pdf?src-supplier=Farnell; ComponentLink15Description: https://datasheet.octopart.com:443/JMK105BJ105KV-F-Taiyo-Yuden-datasheet-10622963.pdf?src-supplier=Farnell; ComponentLink16URL: https://datasheet.octopart.com:443/JMK105BJ105KV-F-Taiyo-Yuden-datasheet-10618026.pdf?src-supplier=Farnell; ComponentLink16Description: https://datasheet.octopart.com:443/JMK105BJ105KV-F-Taiyo-Yuden-datasheet-10618026.pdf?src-supplier=Farnell; ComponentLink17URL: https://datasheet.octopart.com:443/JMK105BJ105KV-F-Taiyo-Yuden-datasheet-10549048.pdf?src-supplier=Farnell; ComponentLink17Description: https://datasheet.octopart.com:443/JMK105BJ105KV-F-Taiyo-Yuden-datasheet-10549048.pdf?src-supplier=Farnell; ComponentLink18URL: https://datasheet.octopart.com:443/JMK105BJ105KV-F-Taiyo-Yuden-datasheet-10671320.pdf?src-supplier=Farnell; ComponentLink18Description: https://datasheet.octopart.com:443/JMK105BJ105KV-F-Taiyo-Yuden-datasheet-10671320.pdf?src-supplier=Farnell; ComponentLink19URL: https://datasheet.octopart.com:443/JMK105BJ105KV-F-Taiyo-Yuden-datasheet-10620942.pdf?src-supplier=Farnell; ComponentLink19Description: https://datasheet.octopart.com:443/JMK105BJ105KV-F-Taiyo-Yuden-datasheet-10620942.pdf?src-supplier=Farnell; ComponentLink20URL: https://datasheet.octopart.com:443/JMK105BJ105KV-F-Taiyo-Yuden-datasheet-10408854.pdf?src-supplier=Farnell; ComponentLink20Description: https://datasheet.octopart.com:443/JMK105BJ105KV-F-Taiyo-Yuden-datasheet-10408854.pdf?src-supplier=Farnell; ComponentLink21URL: https://datasheet.octopart.com:443/JMK105BJ105KV-F-Taiyo-Yuden-datasheet-10283011.pdf?src-supplier=Farnell; ComponentLink21Description: https://datasheet.octopart.com:443/JMK105BJ105KV-F-Taiyo-Yuden-datasheet-10283011.pdf?src-supplier=Farnell; ComponentLink22URL: https://datasheet.octopart.com:443/JMK105BJ105KV-F-Taiyo-Yuden-datasheet-10031713.pdf?src-supplier=Farnell; ComponentLink22Description: https://datasheet.octopart.com:443/JMK105BJ105KV-F-Taiyo-Yuden-datasheet-10031713.pdf?src-supplier=Farnell; ComponentLink23URL: https://datasheet.octopart.com:443/JMK105BJ105KV-F-Taiyo-Yuden-datasheet-10854574.pdf?src-supplier=Farnell; ComponentLink23Description: https://datasheet.octopart.com:443/JMK105BJ105KV-F-Taiyo-Yuden-datasheet-10854574.pdf?src-supplier=Farnell; ComponentLink24URL: https://datasheet.octopart.com:443/JMK105BJ105KV-F-Taiyo-Yuden-datasheet-8820216.pdf?src-supplier=Farnell; ComponentLink24Description: https://datasheet.octopart.com:443/JMK105BJ105KV-F-Taiyo-Yuden-datasheet-8820216.pdf?src-supplier=Farnell; ComponentLink25URL: https://datasheet.octopart.com:443/JMK105BJ105KV-F-Taiyo-Yuden-datasheet-119523.pdf?src-supplier=Farnell; ComponentLink25Description: https://datasheet.octopart.com:443/JMK105BJ105KV-F-Taiyo-Yuden-datasheet-119523.pdf?src-supplier=Farnell; ComponentLink26URL: https://datasheet.octopart.com:443/JMK105BJ105KV-F-Taiyo-Yuden-datasheet-5326109.pdf?src-supplier=Farnell; ComponentLink26Description: https://datasheet.octopart.com:443/JMK105BJ105KV-F-Taiyo-Yuden-datasheet-5326109.pdf?src-supplier=Farnell; ComponentLink27URL: https://datasheet.octopart.com:443/JMK105BJ105KV-F-Taiyo-Yuden-datasheet-118905.pdf?src-supplier=Farnell; ComponentLink27Description: https://datasheet.octopart.com:443/JMK105BJ105KV-F-Taiyo-Yuden-datasheet-118905.pdf?src-supplier=Farnell; ComponentLink28URL: https://datasheet.octopart.com:443/JMK105BJ105KV-F-Taiyo-Yuden-datasheet-1645.pdf?src-supplier=Farnell; ComponentLink28Description: https://datasheet.octopart.com:443/JMK105BJ105KV-F-Taiyo-Yuden-datasheet-1645.pdf?src-supplier=Farnell; ComponentLink29URL: https://datasheet.octopart.com:443/JMK105BJ105KV-F-Taiyo-Yuden-datasheet-138738940.pdf?src-supplier=Taiyo+Yuden+SCT; ComponentLink29Description: https://datasheet.octopart.com:443/JMK105BJ105KV-F-Taiyo-Yuden-datasheet-138738940.pdf?src-supplier=Taiyo+Yuden+SCT; ComponentLink30URL: https://datasheet.octopart.com:443/JMK105BJ105KV-F-Taiyo-Yuden-datasheet-41181654.pdf?src-supplier=Electro+Sonic; ComponentLink30Description: https://datasheet.octopart.com:443/JMK105BJ105KV-F-Taiyo-Yuden-datasheet-41181654.pdf?src-supplier=Electro+Sonic; ComponentLink31URL: https://datasheet.octopart.com:443/JMK105BJ105KV-F-Taiyo-Yuden-datasheet-13693548.pdf?src-supplier=Electro+Sonic; ComponentLink31Description: https://datasheet.octopart.com:443/JMK105BJ105KV-F-Taiyo-Yuden-datasheet-13693548.pdf?src-supplier=Electro+Sonic; ComponentLink32URL: https://datasheet.octopart.com/JMK105BJ105KV-F-Taiyo-Yuden-datasheet-17273223.pdf; ComponentLink32Description: https://datasheet.octopart.com/JMK105BJ105KV-F-Taiyo-Yuden-datasheet-17273223.pdf; ComponentLink33URL: https://datasheet.octopart.com:443/JMK105BJ105KV-F-Taiyo-Yuden-datasheet-8434558.pdf?src-supplier=element14; ComponentLink33Description: https://datasheet.octopart.com:443/JMK105BJ105KV-F-Taiyo-Yuden-datasheet-8434558.pdf?src-supplier=element14
C10 C12 C57 = CL10A106MA8NRNC: 25V 10uF X5R ±20% 0603 Multilayer Ceramic Capacitors MLCC - SMD/SMT ROHS; Manufacturer: Samsung Electro-Mechanics; Value: 10µF; Supplier: DigiKey; Supplier Part Number: 1276-1869-1-ND; Manufacturer Part Number: CL10A106MA8NRNC; RoHS: Compliant; Category: Ceramic Capacitors; Stock: 819895; Pricing: 1=0.09, 10=0.045 (USD); Case/Package: 0603; Case Code (Imperial): 0603; Case Code (Metric): 1608; China RoHS: Compliant; Contact Plating: Tin; Country of Origin: Mainland China, Philippines, South Korea; Dielectric: X5R; Dielectric Material: Ceramic; Export Control Classification Number (ECCN) Code: EAR99; Height: 800µm; Harmonized Tariff Schedule (HTS) Code: 8532.24.00.20; Introduction Date: 2013-01-16; Lead Free: Lead Free; Length: 1.6mm; Lifecycle Status: Production; Material: Ceramic; Max Operating Temperature: 85°C; Min Operating Temperature: -55°C; Mounting Technology: Surface Mount; Number of Terminals: 2; Packaging: Tape & Reel (TR); REACH SVHC: Yes; Schedule B: 8532240020, 8532240020|8532240020|8532240020|8532240020|8532240020|8532240020|8532240020|8532240020|8532240020|8532240020|8532240020, 8532240020|8532240020|8532240020|8532240020|8532240020|8532240020|8532240020|8532240020|8532240020|8532240020|8532240020|8532240020, 8532240020|8532240020|8532240020|8532240020|8532240020|8532240020|8532240020|8532240020|8532240020|8532240020|8532240020|8532240020|8532240020; Termination: Wraparound; Thickness: 889µm; Tolerance: 20%; Voltage Rating: 25V; Voltage Rating (DC): 25V; Width: 800µm; ComponentLink1URL: https://datasheet.octopart.com:443/CL10A106MA8NRNC-Samsung-Electro-Mechanics-datasheet-182019172.pdf?src-supplier=IHS; ComponentLink1Description: https://datasheet.octopart.com:443/CL10A106MA8NRNC-Samsung-Electro-Mechanics-datasheet-182019172.pdf?src-supplier=IHS; ComponentLink2URL: https://datasheet.octopart.com:443/CL10A106MA8NRNC-Samsung-Electro-Mechanics-datasheet-137745063.pdf?src-supplier=Future+Electronics; ComponentLink2Description: https://datasheet.octopart.com:443/CL10A106MA8NRNC-Samsung-Electro-Mechanics-datasheet-137745063.pdf?src-supplier=Future+Electronics; ComponentLink3URL: https://datasheet.octopart.com:443/CL10A106MA8NRNC-Samsung-Electro-Mechanics-datasheet-136031756.pdf?src-supplier=Future+Electronics; ComponentLink3Description: https://datasheet.octopart.com:443/CL10A106MA8NRNC-Samsung-Electro-Mechanics-datasheet-136031756.pdf?src-supplier=Future+Electronics; ComponentLink4URL: https://datasheet.octopart.com:443/CL10A106MA8NRNC-Samsung-Electro-Mechanics-datasheet-110226291.pdf?src-supplier=Future+Electronics; ComponentLink4Description: https://datasheet.octopart.com:443/CL10A106MA8NRNC-Samsung-Electro-Mechanics-datasheet-110226291.pdf?src-supplier=Future+Electronics; ComponentLink5URL: https://datasheet.octopart.com:443/CL10A106MA8NRNC-Samsung-Electro-Mechanics-datasheet-87580073.pdf?src-supplier=Future+Electronics; ComponentLink5Description: https://datasheet.octopart.com:443/CL10A106MA8NRNC-Samsung-Electro-Mechanics-datasheet-87580073.pdf?src-supplier=Future+Electronics; ComponentLink6URL: https://datasheet.octopart.com:443/CL10A106MA8NRNC-Samsung-Electro-Mechanics-datasheet-68300265.pdf?src-supplier=Future+Electronics; ComponentLink6Description: https://datasheet.octopart.com:443/CL10A106MA8NRNC-Samsung-Electro-Mechanics-datasheet-68300265.pdf?src-supplier=Future+Electronics; ComponentLink7URL: https://datasheet.octopart.com:443/CL10A106MA8NRNC-Samsung-datasheet-66660282.pdf?src-supplier=Future+Electronics; ComponentLink7Description: https://datasheet.octopart.com:443/CL10A106MA8NRNC-Samsung-datasheet-66660282.pdf?src-supplier=Future+Electronics; ComponentLink8URL: https://datasheet.octopart.com:443/CL10A106MA8NRNC-Samsung-datasheet-48647236.pdf?src-supplier=Future+Electronics; ComponentLink8Description: https://datasheet.octopart.com:443/CL10A106MA8NRNC-Samsung-datasheet-48647236.pdf?src-supplier=Future+Electronics; ComponentLink9URL: https://datasheet.octopart.com:443/CL10A106MA8NRNC-Samsung-datasheet-39118733.pdf?src-supplier=Future+Electronics; ComponentLink9Description: https://datasheet.octopart.com:443/CL10A106MA8NRNC-Samsung-datasheet-39118733.pdf?src-supplier=Future+Electronics; ComponentLink10URL: https://datasheet.octopart.com:443/CL10A106MA8NRNC-Samsung-Electro-Mechanics-datasheet-149156483.pdf?src-supplier=Future+Electronics; ComponentLink10Description: https://datasheet.octopart.com:443/CL10A106MA8NRNC-Samsung-Electro-Mechanics-datasheet-149156483.pdf?src-supplier=Future+Electronics
C13 C18-C27 C38 = GRM155R71C103KA01D: 16V 10nF X7R ±10% 0402 Multilayer Ceramic Capacitors MLCC - SMD/SMT ROHS; Manufacturer: Murata; Manufacturer Lifecycle Status: NRND; Supplier: DigiKey; Supplier Part Number: 490-1313-2-ND; Manufacturer Part Number: GRM155R71C103KA01D; RoHS: Compliant; Category: Ceramic Capacitors; Stock: 6720000; Pricing: 10000=0.00545, 20000=0.00494, 30000=0.00468, 50000=0.00439, 70000=0.00423, 100000=0.00407, 120000=0.00399, 240000=0.00374, 250000=0.00372 (USD); Value: 10nF; Case/Package: 0402; Case Code (Imperial): 0402; Case Code (Metric): 1005; Depth: 500µm; Dielectric: X7R; Dielectric Material: Ceramic; Height: 500µm; Lead Free: Lead Free; Length: 1mm; Lifecycle Status: NRND; Material: Ceramic; Max Operating Temperature: 125°C; Min Operating Temperature: -55°C; Mounting Technology: Surface Mount; Pins: 2; Number of Terminals: 2; Packaging: Cut Tape; Radiation Hardening: No; REACH SVHC: Yes; Schedule B: 8532240020, 8532240020|8532240020, 8532240020|8532240020|8532240020, 8532240020|8532240020|8532240020|8532240020; Termination: SMD/SMT; Thickness: 500µm; Tolerance: 10%; Voltage: 16V; Voltage Rating: 16V; Voltage Rating (DC): 16V; Width: 500µm; ComponentLink1URL: https://datasheet.octopart.com:443/GRM155R71C103KA01D-Murata-datasheet-8817987.pdf?src-supplier=element14+APAC; ComponentLink1Description: https://datasheet.octopart.com:443/GRM155R71C103KA01D-Murata-datasheet-8817987.pdf?src-supplier=element14+APAC; ComponentLink2URL: https://datasheet.octopart.com:443/GRM155R71C103KA01D-Murata-datasheet-62317116.pdf?src-supplier=element14+APAC; ComponentLink2Description: https://datasheet.octopart.com:443/GRM155R71C103KA01D-Murata-datasheet-62317116.pdf?src-supplier=element14+APAC; ComponentLink3URL: https://datasheet.octopart.com:443/GRM155R71C103KA01D-Murata-datasheet-12547956.pdf?src-supplier=_legacy+Avnet; ComponentLink3Description: https://datasheet.octopart.com:443/GRM155R71C103KA01D-Murata-datasheet-12547956.pdf?src-supplier=_legacy+Avnet; ComponentLink4URL: https://datasheet.octopart.com:443/GRM155R71C103KA01D-Murata-datasheet-8330587.pdf?src-supplier=_legacy+Avnet; ComponentLink4Description: https://datasheet.octopart.com:443/GRM155R71C103KA01D-Murata-datasheet-8330587.pdf?src-supplier=_legacy+Avnet; ComponentLink5URL: https://datasheet.octopart.com:443/GRM155R71C103KA01D-Murata-datasheet-165579666.pdf?src-supplier=TME; ComponentLink5Description: https://datasheet.octopart.com:443/GRM155R71C103KA01D-Murata-datasheet-165579666.pdf?src-supplier=TME; ComponentLink6URL: https://datasheet.octopart.com:443/GRM155R71C103KA01D-Murata-datasheet-59876780.pdf?src-supplier=TME; ComponentLink6Description: https://datasheet.octopart.com:443/GRM155R71C103KA01D-Murata-datasheet-59876780.pdf?src-supplier=TME; ComponentLink7URL: https://datasheet.octopart.com:443/GRM155R71C103KA01D-Murata-datasheet-141266224.pdf?src-supplier=Ciiva; ComponentLink7Description: https://datasheet.octopart.com:443/GRM155R71C103KA01D-Murata-datasheet-141266224.pdf?src-supplier=Ciiva; ComponentLink8URL: https://datasheet.octopart.com:443/GRM155R71C103KA01D-Murata-datasheet-140690969.pdf?src-supplier=Ciiva; ComponentLink8Description: https://datasheet.octopart.com:443/GRM155R71C103KA01D-Murata-datasheet-140690969.pdf?src-supplier=Ciiva; ComponentLink9URL: https://datasheet.octopart.com:443/GRM155R71C103KA01D-Murata-datasheet-138740887.pdf?src-supplier=Ciiva; ComponentLink9Description: https://datasheet.octopart.com:443/GRM155R71C103KA01D-Murata-datasheet-138740887.pdf?src-supplier=Ciiva; ComponentLink10URL: https://datasheet.octopart.com:443/GRM155R71C103KA01D-Murata-datasheet-22122223.pdf?src-supplier=Future+Electronics; ComponentLink10Description: https://datasheet.octopart.com:443/GRM155R71C103KA01D-Murata-datasheet-22122223.pdf?src-supplier=Future+Electronics; ComponentLink11URL: https://datasheet.octopart.com:443/GRM155R71C103KA01D-Murata-datasheet-14400559.pdf?src-supplier=Future+Electronics; ComponentLink11Description: https://datasheet.octopart.com:443/GRM155R71C103KA01D-Murata-datasheet-14400559.pdf?src-supplier=Future+Electronics; ComponentLink12URL: https://datasheet.octopart.com:443/GRM155R71C103KA01D-Murata-datasheet-44106282.pdf?src-supplier=Future+Electronics; ComponentLink12Description: https://datasheet.octopart.com:443/GRM155R71C103KA01D-Murata-datasheet-44106282.pdf?src-supplier=Future+Electronics; ComponentLink13URL: https://datasheet.octopart.com/GRM155R71C103KA01D-Murata-datasheet-12515295.pdf; ComponentLink13Description: https://datasheet.octopart.com/GRM155R71C103KA01D-Murata-datasheet-12515295.pdf; ComponentLink14URL: https://datasheet.octopart.com/GRM155R71C103KA01D-Murata-datasheet-12510076.pdf; ComponentLink14Description: https://datasheet.octopart.com/GRM155R71C103KA01D-Murata-datasheet-12510076.pdf; ComponentLink15URL: https://datasheet.octopart.com/GRM155R71C103KA01D-Murata-datasheet-11978611.pdf; ComponentLink15Description: https://datasheet.octopart.com/GRM155R71C103KA01D-Murata-datasheet-11978611.pdf; ComponentLink16URL: https://datasheet.octopart.com/GRM155R71C103KA01D-Murata-datasheet-10025737.pdf; ComponentLink16Description: https://datasheet.octopart.com/GRM155R71C103KA01D-Murata-datasheet-10025737.pdf; ComponentLink17URL: https://datasheet.octopart.com/GRM155R71C103KA01D-Murata-datasheet-8819587.pdf; ComponentLink17Description: https://datasheet.octopart.com/GRM155R71C103KA01D-Murata-datasheet-8819587.pdf; ComponentLink18URL: https://datasheet.octopart.com/GRM155R71C103KA01D-Murata-datasheet-14400564.pdf; ComponentLink18Description: https://datasheet.octopart.com/GRM155R71C103KA01D-Murata-datasheet-14400564.pdf; ComponentLink19URL: https://datasheet.octopart.com:443/GRM155R71C103KA01D-Murata-datasheet-148211.pdf?src-supplier=Garrett; ComponentLink19Description: https://datasheet.octopart.com:443/GRM155R71C103KA01D-Murata-datasheet-148211.pdf?src-supplier=Garrett; ComponentLink20URL: https://datasheet.octopart.com:443/GRM155R71C103KA01D-Murata-datasheet-102.pdf?src-supplier=DigiKey; ComponentLink20Description: https://datasheet.octopart.com:443/GRM155R71C103KA01D-Murata-datasheet-102.pdf?src-supplier=DigiKey; ComponentLink21URL: http://sigma.octopart.com:80/reach_statement/Murata-company-16.pdf?src-supplier=Compliance+Statements; ComponentLink21Description: http://sigma.octopart.com:80/reach_statement/Murata-company-16.pdf?src-supplier=Compliance+Statements